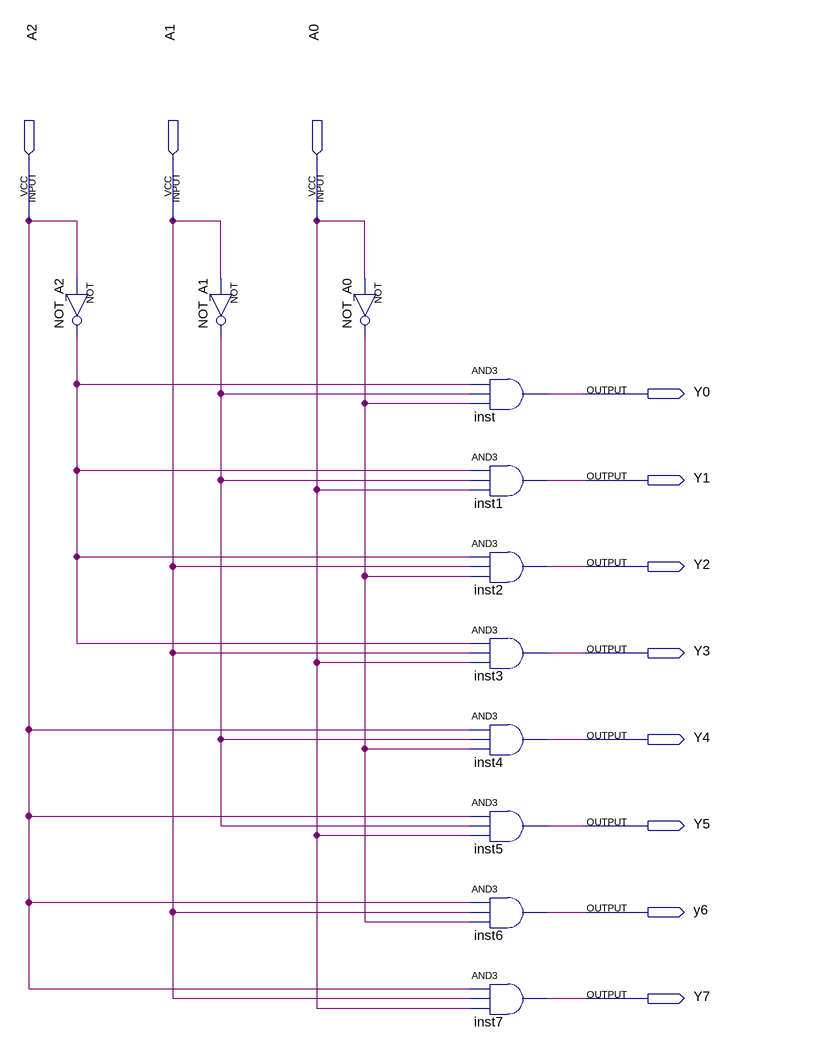
[diagram p0: schematic sheet]
// Quartus schematic 3to8Decoder_Block_diagram.bdf as structural Verilog: 11 symbols, 11 pins
module \3to8Decoder_Block_diagram  (
  input  A2,
  input  A1,
  input  A0,
  output Y0,
  output Y1,
  output Y2,
  output Y3,
  output Y4,
  output Y5,
  output y6,
  output Y7
);

  wire NOT_A0_out, NOT_A1_out, NOT_A2_out;

  not NOT_A2 (NOT_A2_out, A2);
  not NOT_A1 (NOT_A1_out, A1);
  not NOT_A0 (NOT_A0_out, A0);
  and inst (Y0, NOT_A2_out, NOT_A1_out, NOT_A0_out);
  and inst1 (Y1, NOT_A2_out, NOT_A1_out, A0);
  and inst2 (Y2, NOT_A2_out, A1, NOT_A0_out);
  and inst3 (Y3, NOT_A2_out, A1, A0);
  and inst4 (Y4, A2, NOT_A1_out, NOT_A0_out);
  and inst5 (Y5, A2, NOT_A1_out, A0);
  and inst6 (y6, A2, A1, NOT_A0_out);
  and inst7 (Y7, A2, A1, A0);
endmodule
